# EAGLE schematic LAB-PEM300 (EAGLE 6.2)
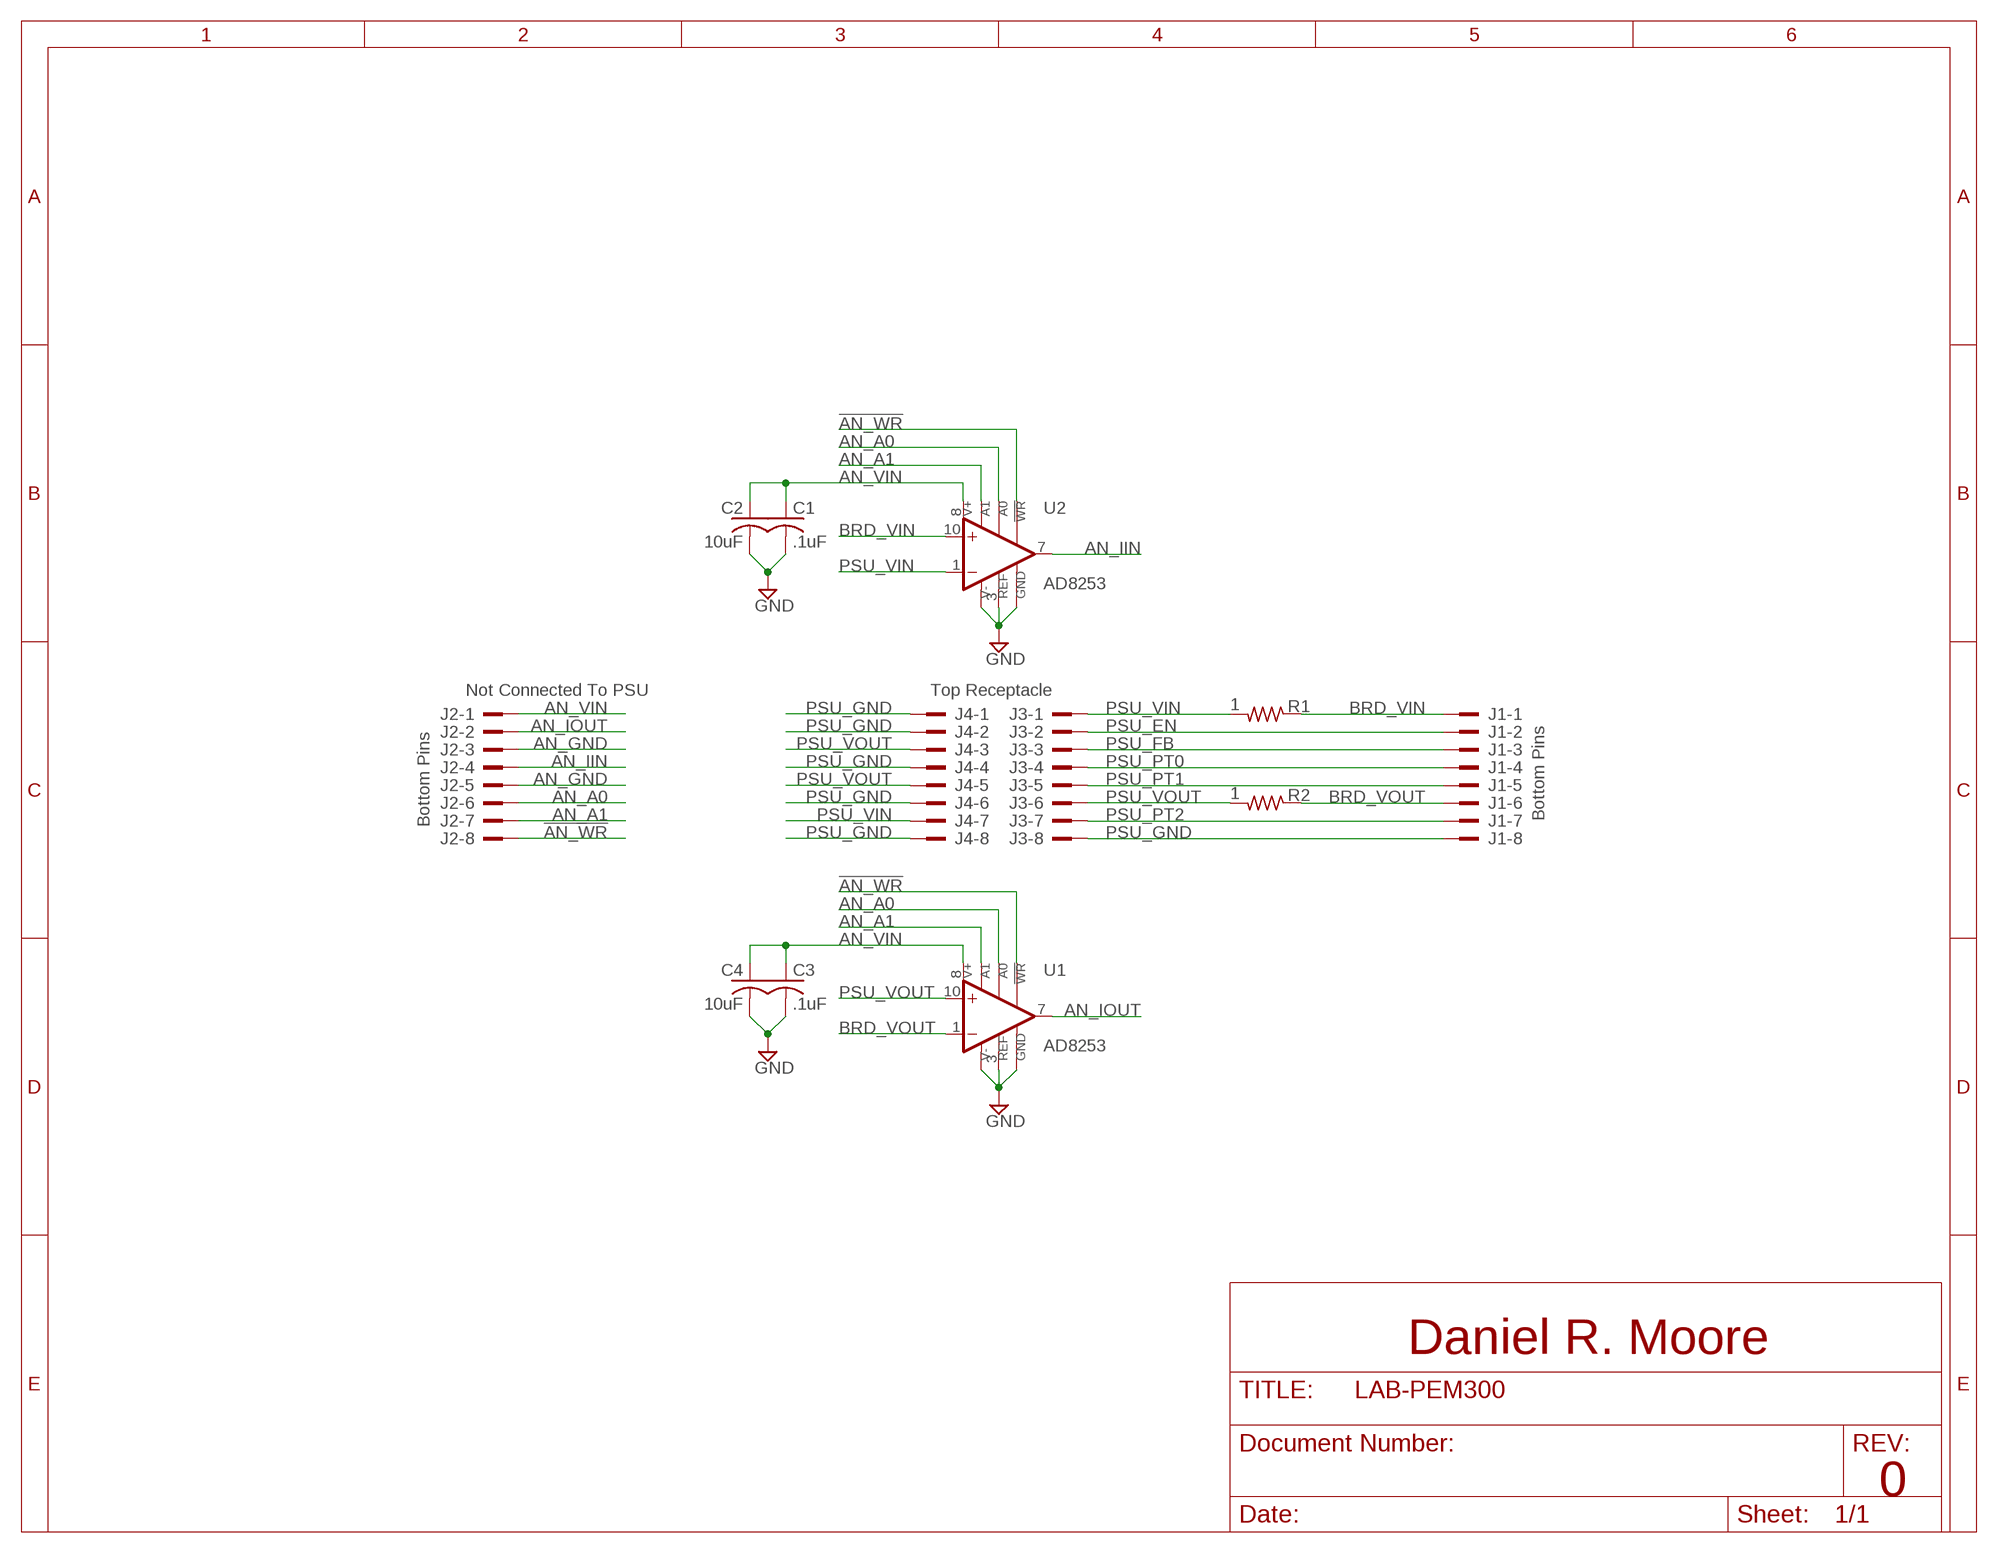
[diagram p0: schematic, sheet 1]

## Parts
C1  .1uF  C-USC0402  [C0402]
C2  10uF  C-USC0402  [C0402]
C3  .1uF  C-USC0402  [C0402]
C4  10uF  C-USC0402  [C0402]
J1  SULLINSSMTPINHEADER-8  [SMTHEADER-8]
J2  SULLINSSMTPINHEADER-8  [SMTHEADER-8]
J3  MILLMAXSMTFEMALE-8  [SMTHEADER-8]
J4  MILLMAXSMTFEMALE-8  [SMTHEADER-8]
R1  1  R-US_R2512  [R2512]
R2  1  R-US_R2512  [R2512]
U1  AD8253  [MSOP10]
U2  AD8253  [MSOP10]

## Nets
!AN_WR: J2.P$8 U1.6(!WR) U2.6(!WR)
AN_A0: J2.P$6 U1.4(A0) U2.4(A0)
AN_A1: J2.P$7 U1.5(A1) U2.5(A1)
AN_GND: C1.2 C2.2 C3.2 C4.2 J2.P$3 J2.P$5 U1.2(DGND) U1.3(V-) U1.9(REF) U2.2(DGND) U2.3(V-) U2.9(REF) ; supply symbol labelled GND
AN_IIN: J2.P$4 U2.7(OUT)
AN_IOUT: J2.P$2 U1.7(OUT)
AN_VIN: C1.1 C2.1 C3.1 C4.1 J2.P$1 U1.8(V+) U2.8(V+)
BRD_VIN: J1.P$1 R1.1 U2.10(+IN)
BRD_VOUT: J1.P$6 R2.1 U1.1(-IN)
PSU_EN: J1.P$2 J3.P$2
PSU_FB: J1.P$3 J3.P$3
PSU_GND: J1.P$8 J3.P$8 J4.P$1 J4.P$2 J4.P$4 J4.P$6 J4.P$8
PSU_PT0: J1.P$4 J3.P$4
PSU_PT1: J1.P$5 J3.P$5
PSU_PT2: J1.P$7 J3.P$7
PSU_VIN: J3.P$1 J4.P$7 R1.2 U2.1(-IN)
PSU_VOUT: J3.P$6 J4.P$3 J4.P$5 R2.2 U1.10(+IN)

## Notes on the sheet
- Not Connected To PSU | Top Receptacle
- Bottom Pins
- Bottom Pins
- Daniel R. Moore
- 0

## Library data of the parts
C1-C4 = rcl:C-US: CAPACITOR, American symbol
J1 J2 = LAB-PEM300:SULLINSSMTPINHEADER-8
J3 J4 = LAB-PEM300:MILLMAXSMTFEMALE-8
R1 R2 = rcl:R-US_: RESISTOR, American symbol
U1 U2 = LAB-PEM300:AD8253